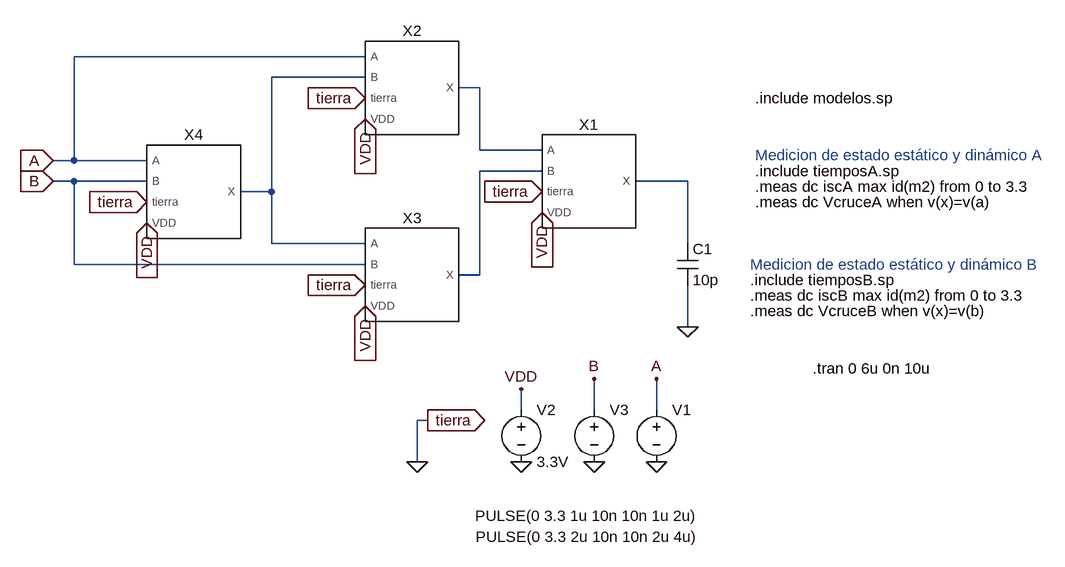
[diagram p0: schematic Xnor_3mA.asc]
Xnor_3mA.asc, the LTspice schematic file:
Version 4
SHEET 1 1484 824
WIRE -160 -176 -608 -176
WIRE -160 -144 -304 -144
WIRE 16 -128 -16 -128
WIRE 16 -32 16 -128
WIRE 112 -32 16 -32
WIRE -608 -16 -608 -176
WIRE -608 -16 -640 -16
WIRE -496 -16 -608 -16
WIRE 112 0 16 0
WIRE -608 16 -640 16
WIRE -496 16 -608 16
WIRE 336 16 256 16
WIRE -304 32 -304 -144
WIRE -304 32 -352 32
WIRE -304 112 -304 32
WIRE -160 112 -304 112
WIRE 336 112 336 16
WIRE -608 144 -608 16
WIRE -160 144 -608 144
WIRE 16 160 16 0
WIRE 16 160 -16 160
WIRE 336 240 336 176
WIRE 80 368 80 336
WIRE 192 368 192 320
WIRE 288 368 288 320
WIRE -64 384 -80 384
WIRE -80 448 -80 384
FLAG 80 336 VDD
FLAG 288 320 A
FLAG 192 320 B
FLAG 80 448 0
FLAG 192 448 0
FLAG 288 448 0
FLAG 112 32 tierra
IOPIN 112 32 In
FLAG 112 64 VDD
IOPIN 112 64 In
FLAG -160 -112 tierra
IOPIN -160 -112 In
FLAG -160 -80 VDD
IOPIN -160 -80 In
FLAG -160 176 tierra
IOPIN -160 176 In
FLAG -160 208 VDD
IOPIN -160 208 In
FLAG -640 -16 A
IOPIN -640 -16 In
FLAG -640 16 B
IOPIN -640 16 In
FLAG -496 48 tierra
IOPIN -496 48 In
FLAG -496 80 VDD
IOPIN -496 80 In
FLAG 336 240 0
FLAG -80 448 0
FLAG -64 384 tierra
IOPIN -64 384 Out
SYMBOL voltage 288 352 R0
WINDOW 3 -279 179 Left 2
WINDOW 123 0 0 Left 0
WINDOW 39 0 0 Left 0
SYMATTR Value PULSE(0 3.3 1u 10n 10n 1u 2u)
SYMATTR InstName V1
SYMBOL voltage 80 352 R0
WINDOW 123 0 0 Left 0
WINDOW 39 0 0 Left 0
SYMATTR InstName V2
SYMATTR Value 3.3V
SYMBOL cap 320 112 R0
SYMATTR InstName C1
SYMATTR Value 10p
SYMBOL voltage 192 352 R0
WINDOW 3 -182 211 Left 2
WINDOW 123 0 0 Left 0
WINDOW 39 0 0 Left 0
SYMATTR Value PULSE(0 3.3 2u 10n 10n 2u 4u)
SYMATTR InstName V3
SYMBOL Instancia_NOR_3mA 176 16 R0
SYMATTR InstName X1
SYMBOL Instancia_NOR_3mA -96 -128 R0
SYMATTR InstName X2
SYMBOL Instancia_NOR_3mA -96 160 R0
SYMATTR InstName X3
SYMBOL Instancia_NOR_3mA -432 32 R0
SYMATTR InstName X4
TEXT 440 -112 Left 2 !.include modelos.sp
TEXT 440 48 Left 2 !.meas dc VcruceA when v(x)=v(a)
TEXT 440 0 Left 2 !.include tiemposA.sp
TEXT 440 24 Left 2 !.meas dc iscA max id(m2) from 0 to 3.3
TEXT 440 -24 Left 2 ;Medicion de estado estático y dinámico A
TEXT 432 216 Left 2 !.meas dc VcruceB when v(x)=v(b)
TEXT 432 192 Left 2 !.meas dc iscB max id(m2) from 0 to 3.3
TEXT 432 144 Left 2 ;Medicion de estado estático y dinámico B
TEXT 432 168 Left 2 !.include tiemposB.sp
TEXT 528 304 Left 2 !.tran 0 6u 0n 10u

The netlist it stands for:
* Xnor_3mA.asc
V1 A 0 PULSE(0 3.3 1u 10n 10n 1u 2u)
V2 VDD 0 3.3V
C1 N004 0 10p
V3 B 0 PULSE(0 3.3 2u 10n 10n 2u 4u)
XX1 N002 N003 0 VDD N004 Instancia_NOR_3mA  ; pins A B tierra VDD X
XX2 A N001 0 VDD N002 Instancia_NOR_3mA  ; pins A B tierra VDD X
XX3 N001 B 0 VDD N003 Instancia_NOR_3mA  ; pins A B tierra VDD X
XX4 A B 0 VDD N001 Instancia_NOR_3mA  ; pins A B tierra VDD X
.include modelos.sp
.meas dc VcruceA when v(x)=v(a)
.include tiemposA.sp
.meas dc iscA max id(m2) from 0 to 3.3
* Medicion de estado estático y dinámico A
.meas dc VcruceB when v(x)=v(b)
.meas dc iscB max id(m2) from 0 to 3.3
* Medicion de estado estático y dinámico B
.include tiemposB.sp
.tran 0 6u 0n 10u
.backanno
.end

* Results of the author's LTspice run, read from the files saved beside the schematic
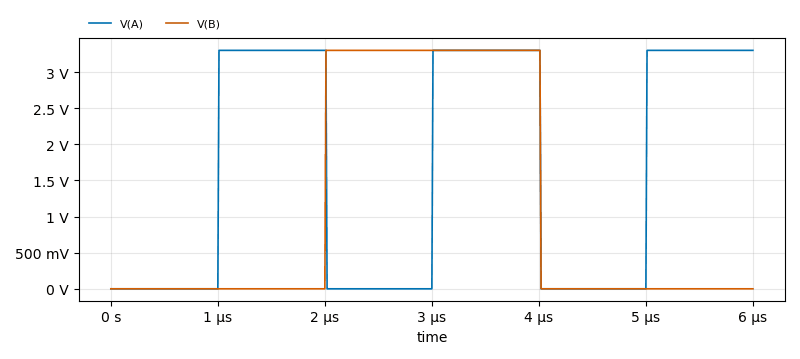
[diagram p1: Transient Analysis of Xnor_3mA.asc, plotted from the saved traces]
* Transient Analysis, 1 run:
*   V(A): min 0 V, max 3.3 V, average 1.658 V, rms 2.336 V, last 3.3 V
*   V(B): min 0 V, max 3.3 V, average 1.105 V, rms 1.908 V, last 0 V